# Altium schematic sheet smart-gate-driver.SchDoc
size A4
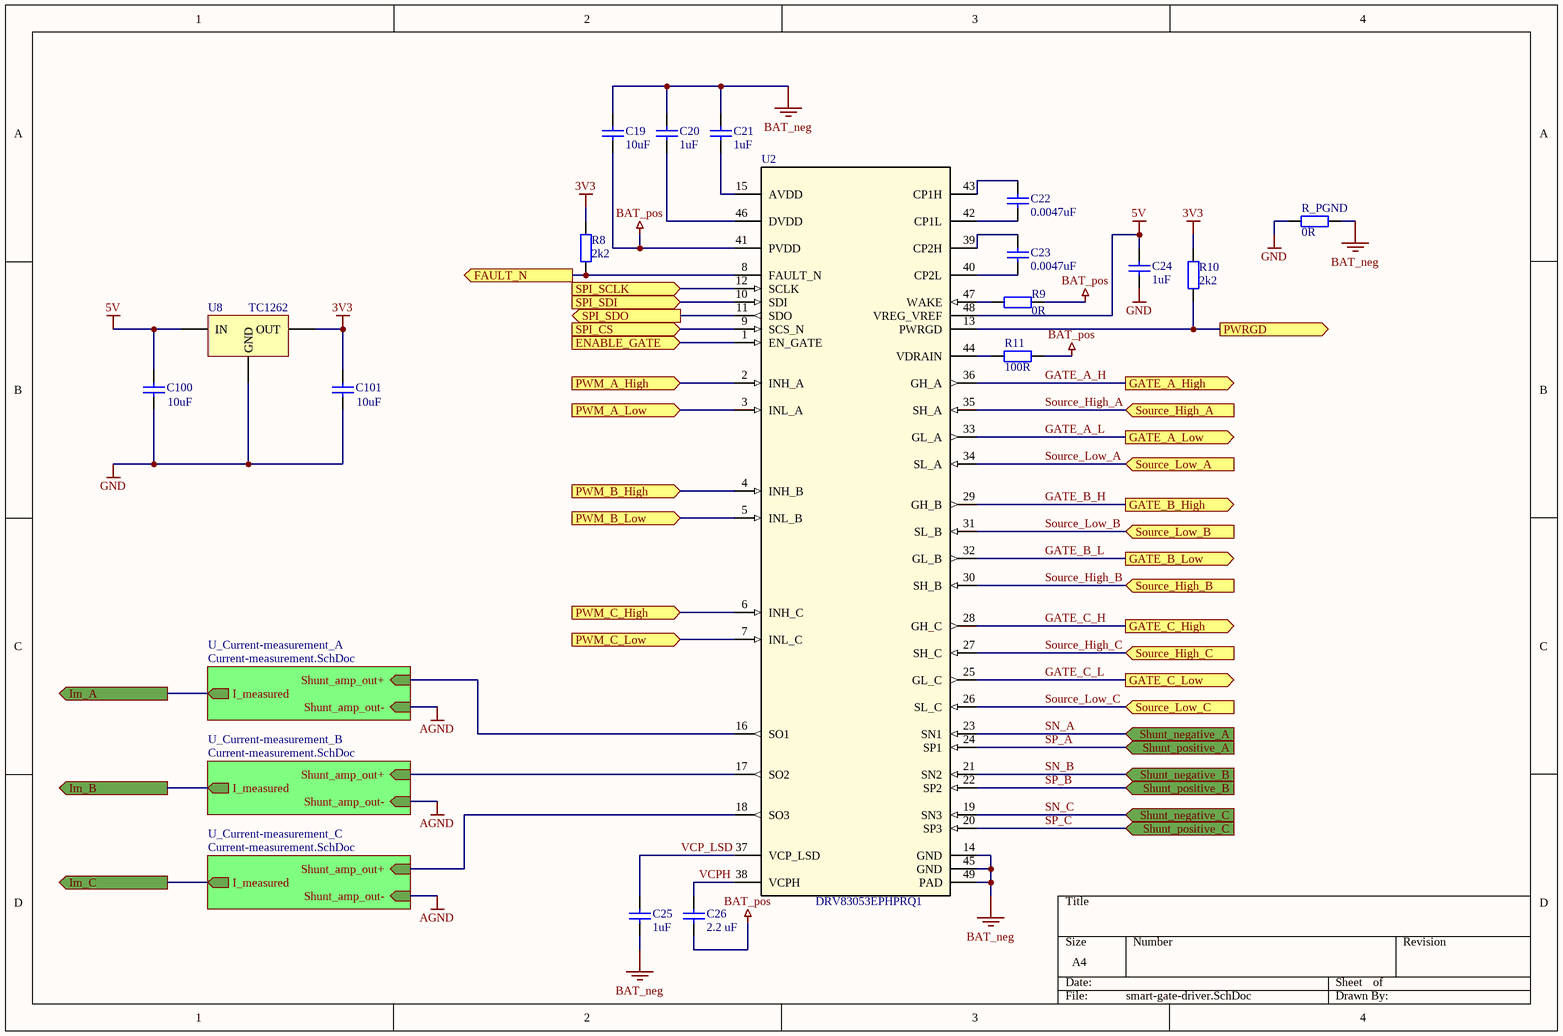
[diagram p0: smart-gate-driver.SchDoc]

## Parts
C19  10uF  [FP_0603_CAP_080]
C20  1uF  [FP_0603_CAP_080]
C21  1uF  [FP_0603_CAP_080]
C22  0.0047uF  [FP_0603_CAP_080]
C23  0.0047uF  [FP_0603_CAP_080]
C24  1uF  [FP_0603_CAP_080]
C25  1uF  [FP_0603_CAP_080]
C26  2.2 uF  [FP_0603_CAP_080]
C100  10uF  [FP_0603_CAP_080]
C101  10uF  [FP_0603_CAP_080]
R8  2k2  [FP_0603_RES]
R9  0R  [FP_0603_RES]
R10  2k2  [FP_0603_RES]
R11  100R  [FP_0603_RES]
R_PGND  0R  [FP_0805_RES]
U2  DRV83053EPHPRQ1  [PHP0048G_M]
U8  TC1262  [FP_SOT223]

## Sub-sheets
U_Current-measurement_A = Current-measurement.SchDoc: Shunt_amp_out+ (in), Shunt_amp_out- (in), I_measured (out)
U_Current-measurement_B = Current-measurement.SchDoc: Shunt_amp_out+ (in), Shunt_amp_out- (in), I_measured (out)
U_Current-measurement_C = Current-measurement.SchDoc: Shunt_amp_out+ (in), Shunt_amp_out- (in), I_measured (out)

## Ports
ENABLE_GATE (in), FAULT_N (out), GATE_A_High (out), GATE_A_Low (out), GATE_B_High (out), GATE_B_Low (out), GATE_C_High (out), GATE_C_Low (out), Im_A (out), Im_B (out), Im_C (out), PWM_A_High (in), PWM_A_Low (in), PWM_B_High (in), PWM_B_Low (in), PWM_C_High (in), PWM_C_Low (in), PWRGD (out), Shunt_negative_A (in), Shunt_negative_B (in), Shunt_negative_C (in), Shunt_positive_A (in), Shunt_positive_B (in), Shunt_positive_C (in), Source_High_A (in), Source_High_B (in), Source_High_C (in), Source_Low_A (in), Source_Low_B (in), Source_Low_C (in), SPI_CS (in), SPI_SCLK (in), SPI_SDI (in), SPI_SDO (out)

## Nets
3V3: C101.2 R8.2 R10.1 U8.3(OUT)
5V: C24.2 C100.2 U2.48(VREG_VREF) U8.1(IN)
AGND: sheet U_Current-measurement_A/Shunt_amp_out-, sheet U_Current-measurement_B/Shunt_amp_out-, sheet U_Current-measurement_C/Shunt_amp_out-
BAT_neg: C19.1 C20.2 C21.2 C25.1 R_PGND.2 U2.14(GND) U2.45(GND) U2.49(PAD)
BAT_pos: C19.2 C26.2 R9.2 R11.2 U2.41(PVDD)
GND: C24.1 C100.1 C101.1 R_PGND.1 U8.2(GND)
ENABLE_GATE: U2.1(EN_GATE) ; port ENABLE_GATE
FAULT_N: R8.1 U2.8(FAULT_N) ; port FAULT_N
GATE_A_H: U2.36(GH_A) ; port GATE_A_High
GATE_A_L: U2.33(GL_A) ; port GATE_A_Low
GATE_B_H: U2.29(GH_B) ; port GATE_B_High
GATE_B_L: U2.32(GL_B) ; port GATE_B_Low
GATE_C_H: U2.28(GH_C) ; port GATE_C_High
GATE_C_L: U2.25(GL_C) ; port GATE_C_Low
Im_A: port Im_A, sheet U_Current-measurement_A/I_measured
Im_B: port Im_B, sheet U_Current-measurement_B/I_measured
Im_C: port Im_C, sheet U_Current-measurement_C/I_measured
PWM_A_High: U2.2(INH_A) ; port PWM_A_High
PWM_A_Low: U2.3(INL_A) ; port PWM_A_Low
PWM_B_High: U2.4(INH_B) ; port PWM_B_High
PWM_B_Low: U2.5(INL_B) ; port PWM_B_Low
PWM_C_High: U2.6(INH_C) ; port PWM_C_High
PWM_C_Low: U2.7(INL_C) ; port PWM_C_Low
PWRGD: R10.2 U2.13(PWRGD) ; port PWRGD
SN_A: U2.23(SN1) ; port Shunt_negative_A
SN_B: U2.21(SN2) ; port Shunt_negative_B
SN_C: U2.19(SN3) ; port Shunt_negative_C
Source_High_A: U2.35(SH_A) ; port Source_High_A
Source_High_B: U2.30(SH_B) ; port Source_High_B
Source_High_C: U2.27(SH_C) ; port Source_High_C
Source_Low_A: U2.34(SL_A) ; port Source_Low_A
Source_Low_B: U2.31(SL_B) ; port Source_Low_B
Source_Low_C: U2.26(SL_C) ; port Source_Low_C
SP_A: U2.24(SP1) ; port Shunt_positive_A
SP_B: U2.22(SP2) ; port Shunt_positive_B
SP_C: U2.20(SP3) ; port Shunt_positive_C
SPI_CS: U2.9(SCS_N) ; port SPI_CS
SPI_SCLK: U2.12(SCLK) ; port SPI_SCLK
SPI_SDI: U2.10(SDI) ; port SPI_SDI
SPI_SDO: U2.11(SDO) ; port SPI_SDO
VCP_LSD: C25.2 U2.37(VCP_LSD)
VCPH: C26.1 U2.38(VCPH)
NetC20_1: C20.1 U2.46(DVDD)
NetC21_1: C21.1 U2.15(AVDD)
NetC22_1: C22.1 U2.42(CP1L)
NetC22_2: C22.2 U2.43(CP1H)
NetC23_1: C23.1 U2.40(CP2L)
NetC23_2: C23.2 U2.39(CP2H)
NetR9_1: R9.1 U2.47(WAKE)
NetR11_1: R11.1 U2.44(VDRAIN)
NetU2_16: U2.16(SO1) ; sheet U_Current-measurement_A/Shunt_amp_out+
NetU2_17: U2.17(SO2) ; sheet U_Current-measurement_B/Shunt_amp_out+
NetU2_18: U2.18(SO3) ; sheet U_Current-measurement_C/Shunt_amp_out+

## Library data of the parts
C19-C26 C100 C101 = CAP: Capacitor
  C19: Value: 10uF
  C20 C21 C24 C25: Value: 1uF
  C22 C23: Value: 0.0047uF
  C26: Value: 2.2 uF
R8-R11 R_PGND = RES: Resistor
  R8 R10: Value: 2k2
  R9 R_PGND: Value: 0R
  R11: Value: 100R
U2 = DRV83055: Motor Driver, 3-Phase Brushless DC, 4.4V to 45V supply, 80 mA/1 Output, HTQFP-48; Manufacturer:: TEXAS INSTRUMENTS; Manufacturer Part No:: DRV83053PHPR; Order Code:: 2611247; Supplier: Farnell / Mouser; ComponentLink1Description: farnell.com; ComponentLink1URL: https://hu.farnell.com/texas-instruments/drv83053phpr/motor-driver-3p-bldc-0-08a-htqfp/dp/2611247?st=DRV83053PHPR%20.; ComponentLink2Description: mouser.com; ComponentLink2URL: https://hu.mouser.com/ProductDetail/Texas-Instruments/DRV83053PHPR?qs=sGAEpiMZZMtKB4wrjsn3lRA0sVHrgdefL%252BtZWiYXzuY%3D
U8 = TC1262: TC1262-3.3VDB -  Fixed LDO Voltage Regulator, 2.7V to 6V, 350mV Dropout, 3.3Vout, 500mAout, SOT-223-3; ComponentLink1Description: Farnell.com; ComponentLink1URL: https://hu.farnell.com/microchip/tc1262-3-3vdb/ic-ldo-500ma-3-3v-sot223-3/dp/1852183?krypto=Z9yKr3sEev96lCFTtZI6KGaxPtnuQnb1T4ViDd%2FnyMNeEDWD2qqoEvziga%2F4xnVwdpU%2FoX3let48tbk1C5kMGRAfemZn0l3OMnA2xCXuAvPFaoGbxobFqaPxgX7JG6PeQ78hNVpwY%2BCYhCFWhpb6g9HxqnoSd3nd2AM8qXrIomxVX6c5locpZ86MKP6hCMhu&ddkey=https%3Ahu-HU%2FElement14_Hungary%2Fw%2Fsearch